# Altium schematic sheet BMS-S03-V01-CellInterface.SchDoc: Cell Balancing
size A3; DrawnBy: Sam Haines; DocumentNumber: 6; Revision: 01; SheetNumber: 6; SheetTotal: 10; Version: 01; Project: Battery Managment System 2020; PageSetup: Record=PageOptions|CenterHorizontal=True|CenterVertical=True|PrintScale=0.97|XCorrection=1.00|YCorrection=1.00|PrintKind=0|BorderSize=5000000|LeftOffset=0|BottomOffset=0|Orientation=2|PaperLength=1000|PaperWidth=1000|Scale=100|PaperSource=7|PrintQuality=-4|MediaType=1|DitherType=10|PaperKind=A4|PrintScaleMode=1
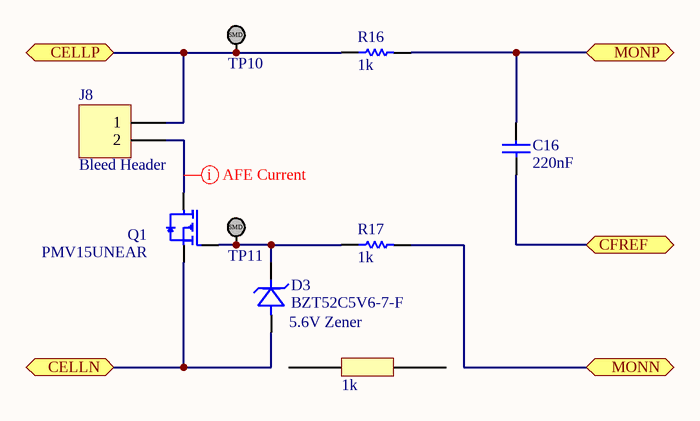
[diagram p0: BMS-S03-V01-CellInterface.SchDoc]

## Parts
C16  220nF  [Cap_Ceramic_0603]
D3  BZT52C5V6-7-F  [SOD123]
J8  Bleed Header  [HDR1X2]
Q1  MOSFET N  [PMV15UNEAR]  (value not drawn)
R16  1k  [Res_ThinFilm_0603]
R17  1k  [Res_ThinFilm_0603]
TP10  TestPoint_SMD  [TestPointSMD]  (value not drawn)
TP11  TestPoint_SMD  [TestPointSMD]  (value not drawn)

## Ports
CELLN (bidir), CELLP (bidir), CFREF (bidir), MONN (bidir), MONP (bidir)

## Nets
CELLN: D3.A(Anode) Q1.S(Source) ; port CELLN
CELLP: J8.1 R16.1 TP10.1 ; port CELLP
CFREF: C16.1 ; port CFREF
MONN: R17.2 ; port MONN
MONP: C16.2 R16.2 ; port MONP
NetD3_K: D3.K(Cathode) Q1.G(Gate) R17.1 TP11.1
NetJ8_2: J8.2 Q1.D(Drain)

## Layout directives
rule Width Constraint [Pref Width = 20mil    Min Width = 15mil    Max Width = 30mil]: NetJ8_2

## Notes on the sheet
- (near D3) 5.6V Zener
- 1k
- Revision History:
- Sheet Title:
- Rev
- Date
- Description
- Project:
- Size:
- Drawn By:
- A3
- Number:
- Revision:
- Sheet
- Version:
- of
- QUT Motorsport
- O-120, Gardens Point
- 2 George Street
- Brisbane, QLD 4000
- Australia
- Print Date:
- Print Time:
- File Name:
- (in symbol TestPoint_SMD) SMD

## Library data of the parts
C16 = 220nF 50V 5% X7R 0603: Capacitor, Ceramic, SMD, 220nF, 50V, 5%, X7R, 0603
D3 = BZT52C5V6-7-F: Diode, SMD, Zender, 5.6V, 7%, 500mW, SOD-123; Manufacturer: Generic; MPN: 1.8V 500mW
J8 = Header 2: Header, 2-Pin; LatestRevisionDate: 17-Jul-2002; LatestRevisionNote: Re-released for DXP Platform.; Publisher: Altium Limited
Q1 = PMV15UNEAR: MOSFET N-CH, 20V, SOT23; Manufacturer: Nexperia; Manufacturer Part Number: PMV15UNEAR
R16 R17 = 1k 5% 0603: Resistor, SMD, 1k, 0.1W, 5%, 0603